# EasyEDA Pro project ProPrj_MN42_2025-04-17.epro, board btnBRD
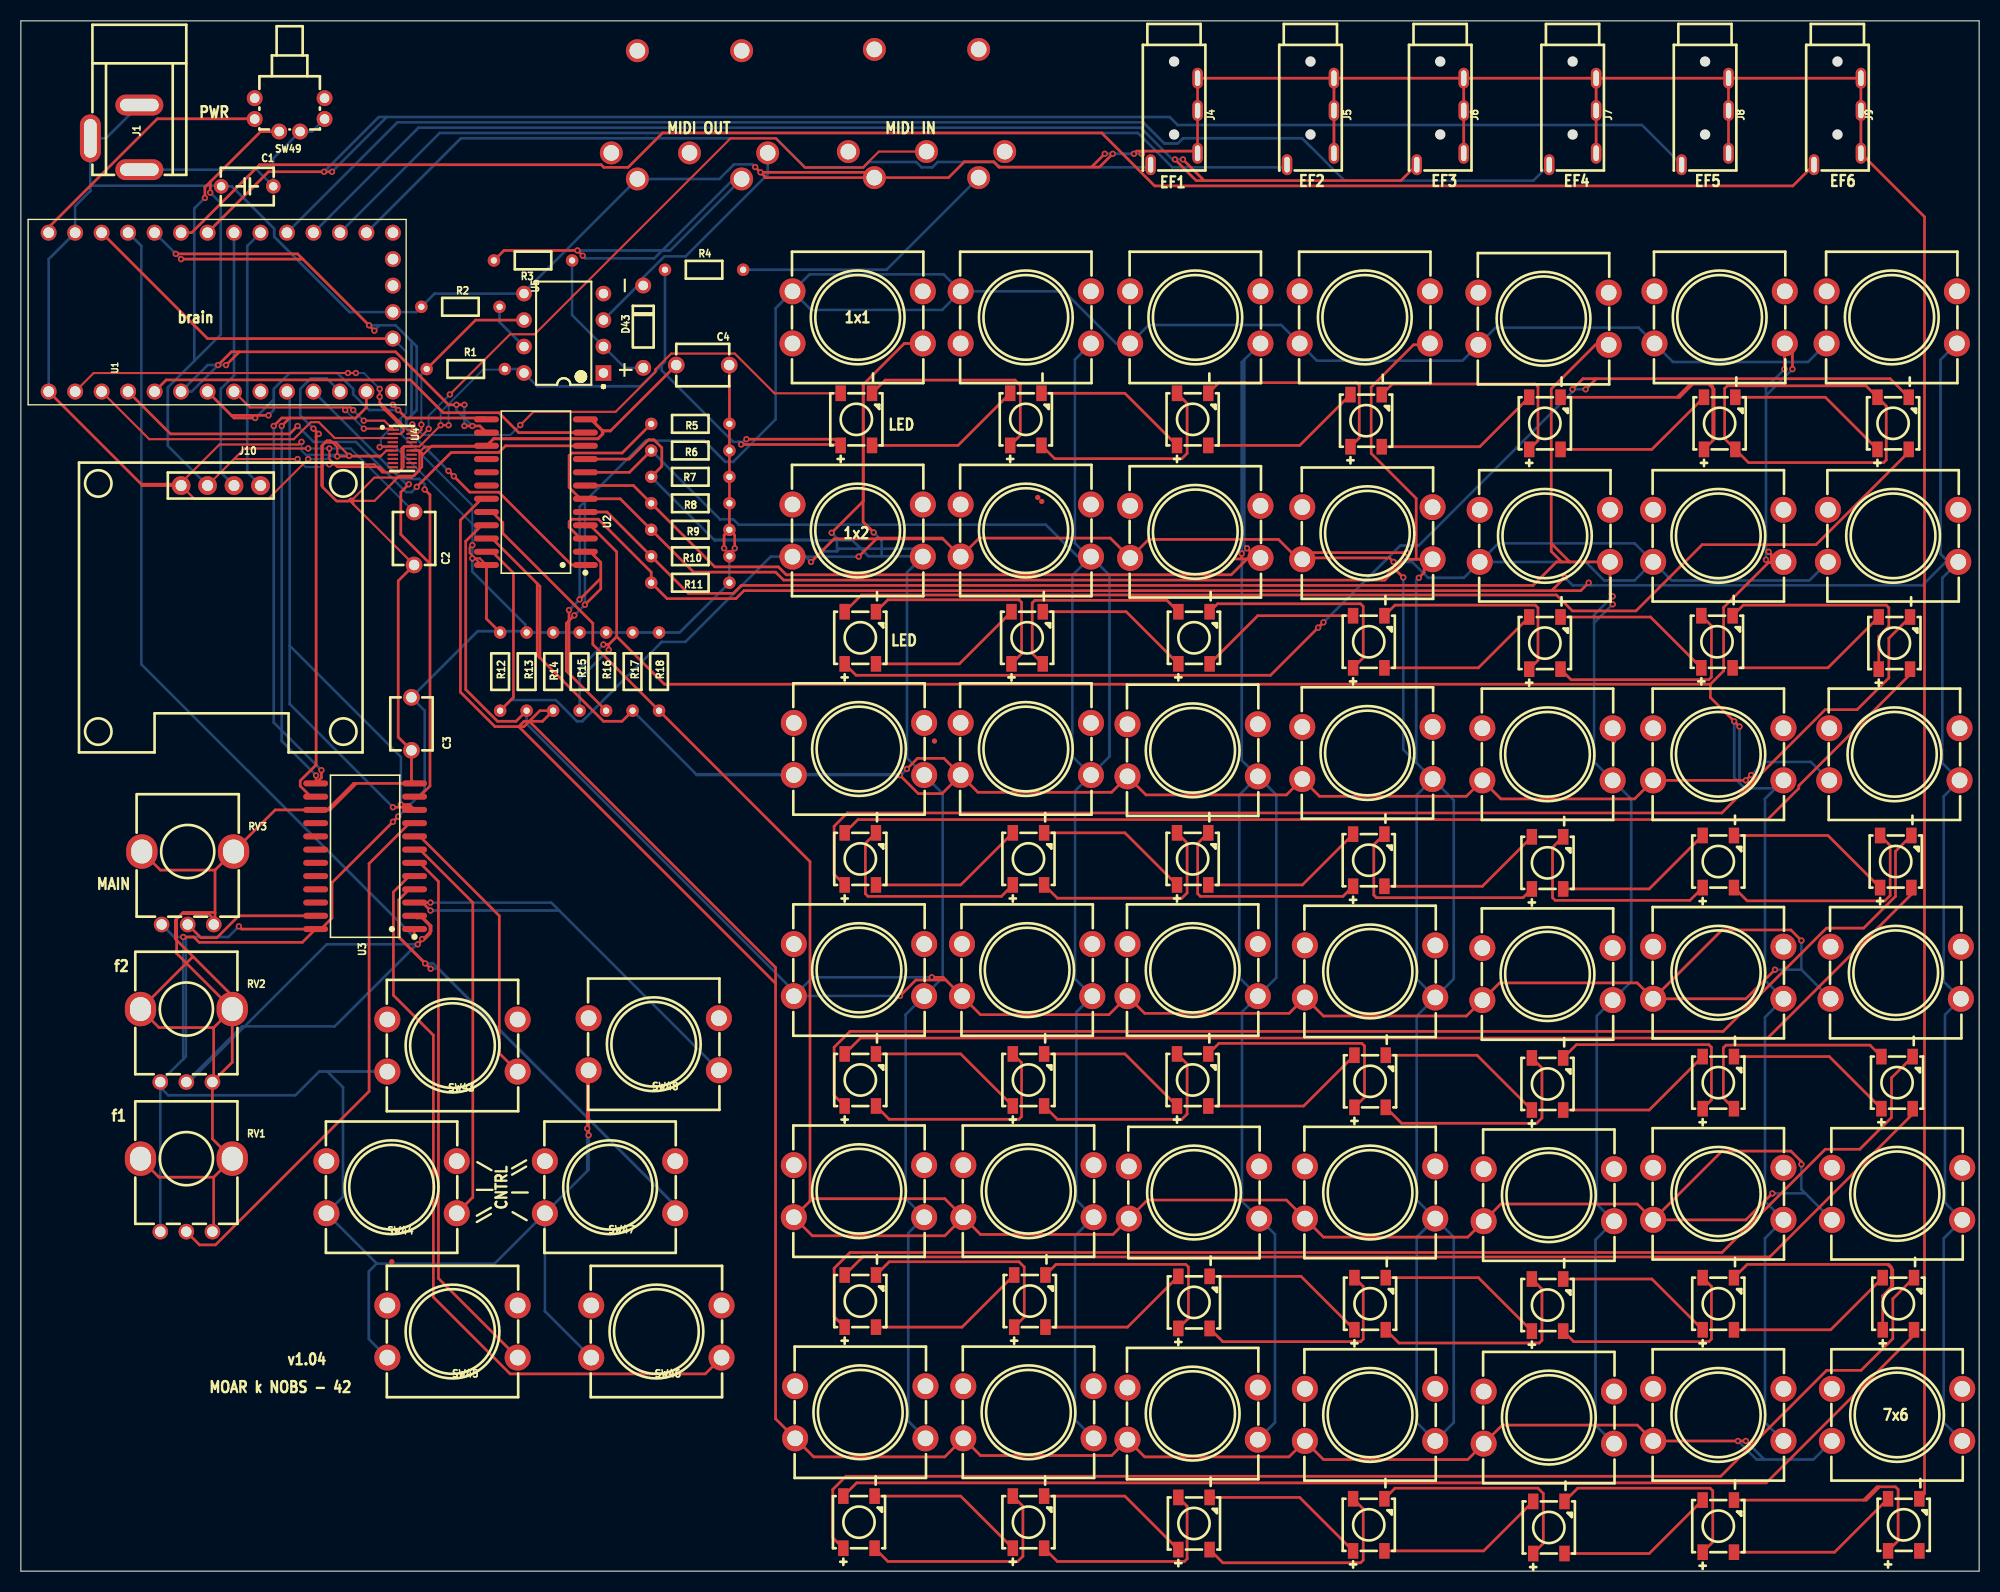
[diagram p1: board, top side]
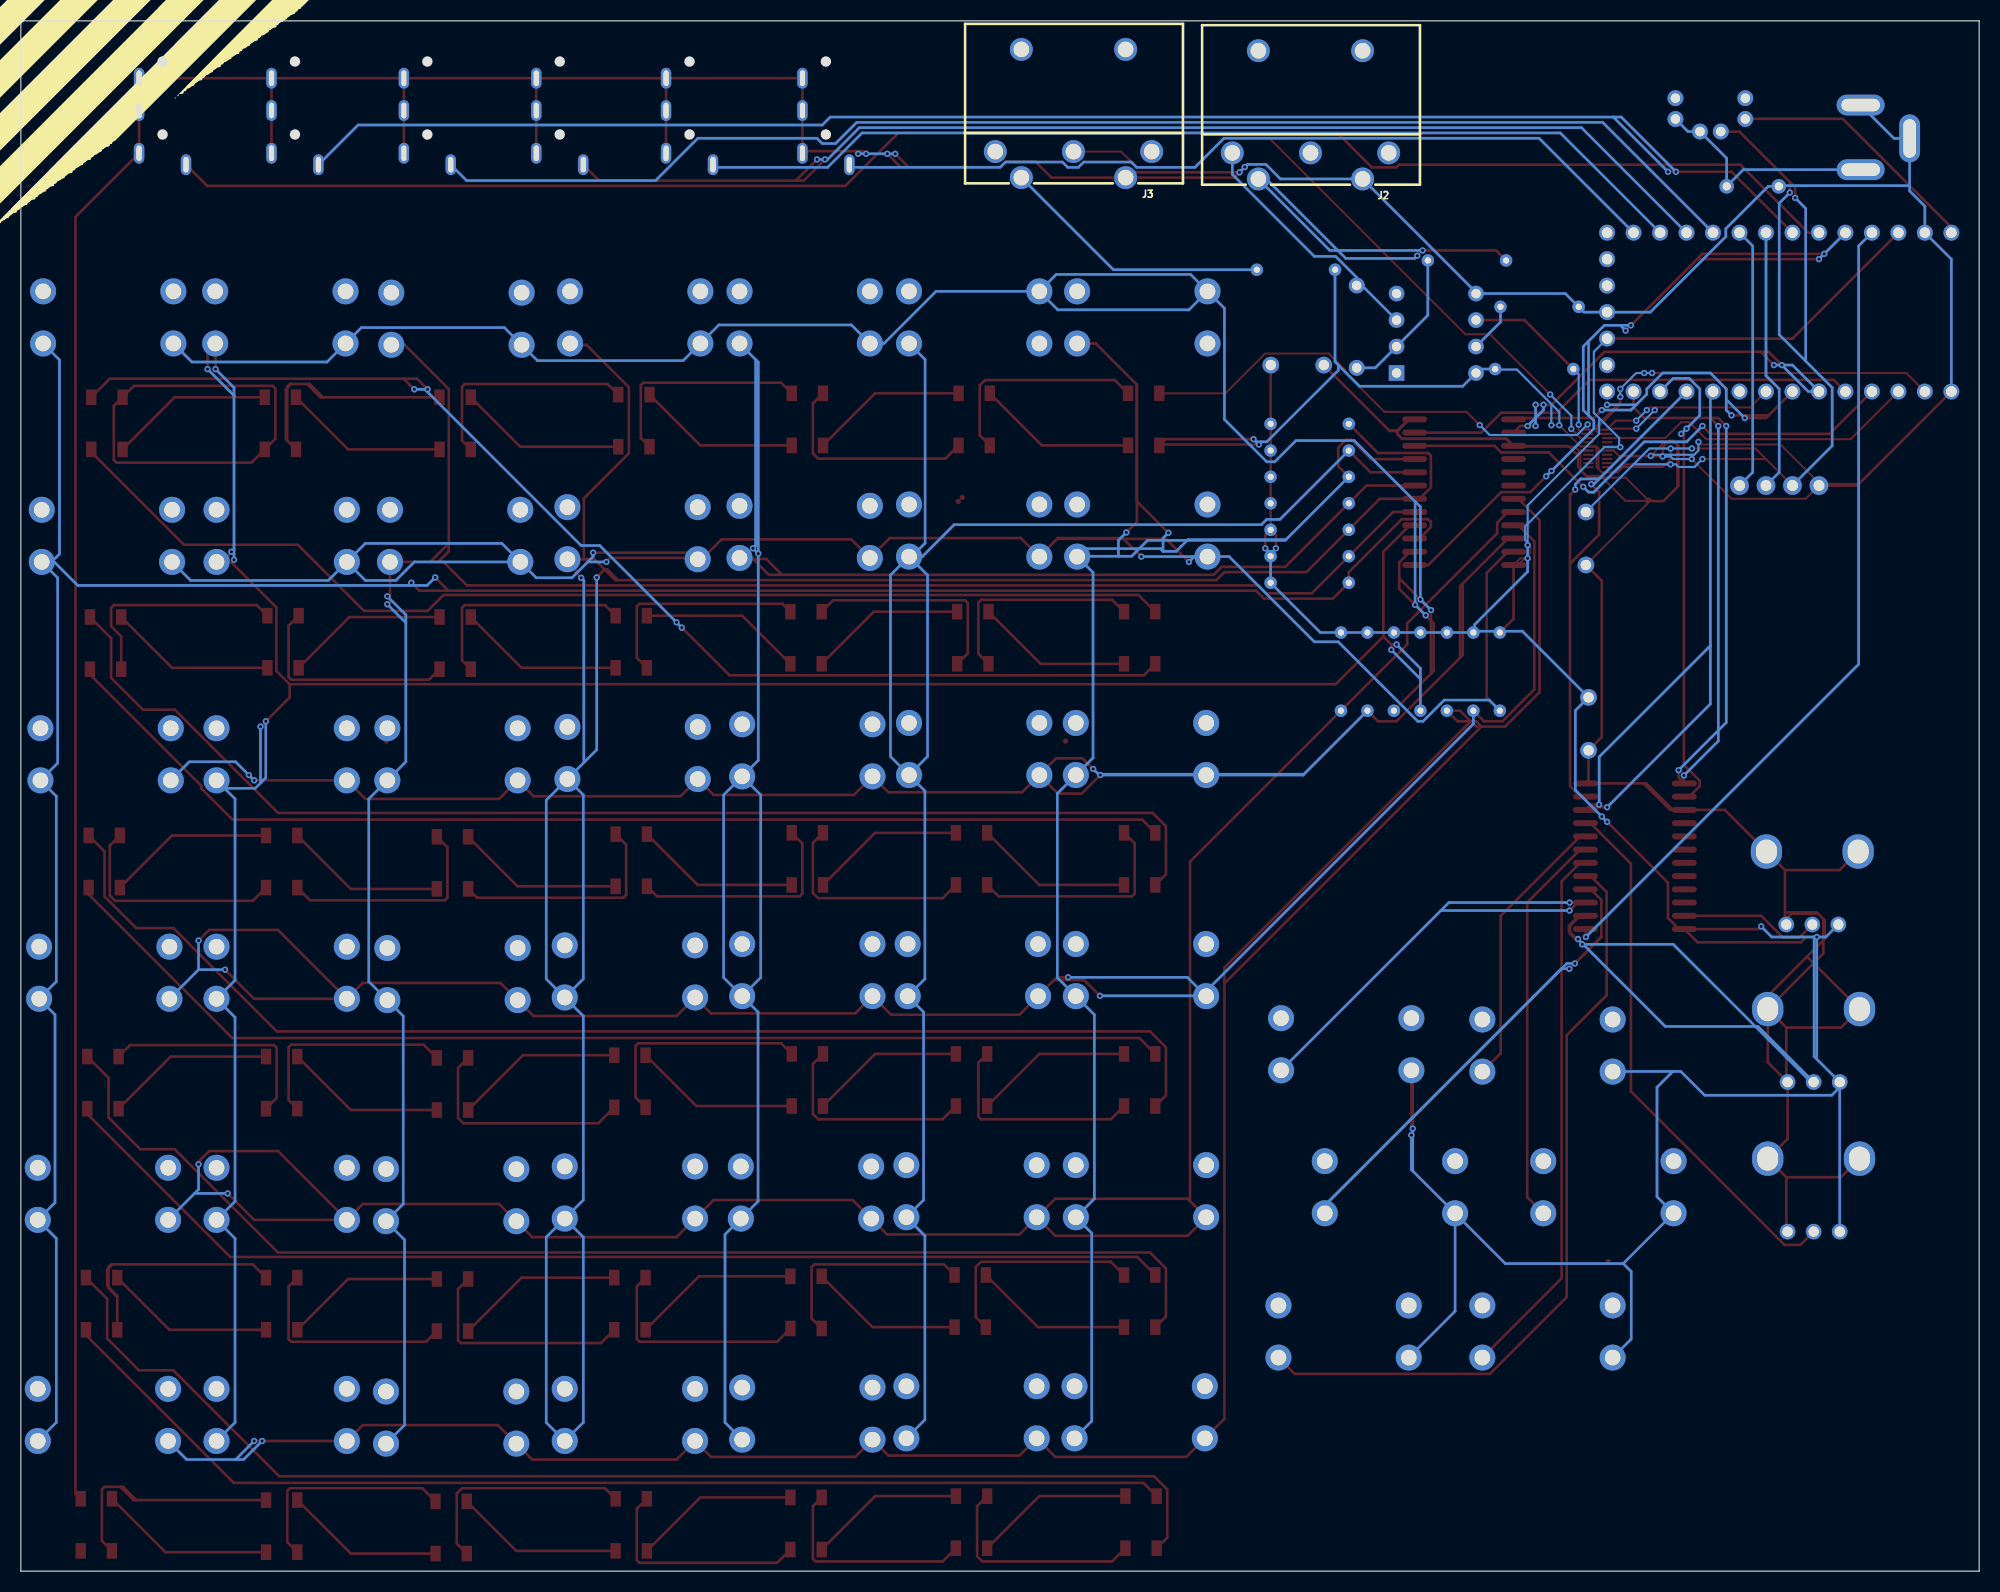
[diagram p2: board, bottom side, seen from below]

Outline 187.83 x 148.72 mm; copper layers: Top Layer, Bottom Layer. Coordinates in mm from the lower left corner of the outline.
Outline path: 0,148.72 0,0 187.83,0 187.83,148.72 0,148.72
Stack: Top Layer 0.035mm / Dielectric1 1.51mm FR4 er 4.5 / Bottom Layer 0.035mm

## Design rules (mm)
spacing safeClearance (default): track to track 0.152, other pairs 0.152 to 0.3
track width trackWidth (default): min 0.127, default 0.254, max 2.54
differential pair differentialPair (default): width min 0.127, default 0.254, max 2.54; gap min 0.152, default 0.152
via viaSize (default): diameter min 0.5, default 0.61, max 10; hole min 0.3, default 0.305, max 6

## Placement (name value [footprint] x y rotation side)
C1  10uF  [CAP-TH_L5.5-W3.5-P5.00-D0.5]  21.72 132.84 0 top
C2  100nF  [CAP-TH_L5.0-W4.0-P5.00-D1.0]  37.72 99.06 270 top
C3  100nF  [CAP-TH_L5.0-W4.0-P5.00-D1.0]  37.47 81.28 90 top
C4  100nF  [CAP-TH_L5.0-W4.0-P5.00-D1.0]  65.41 115.7 0 top
D1  XL-5050RGBC-WS2812B  [LED-SMD_4P-L5.0-W5.0-BL_XL-5050RGBC]  80.14 110.49 0 top
D2  XL-5050RGBC-WS2812B  [LED-SMD_4P-L5.0-W5.0-BL_XL-5050RGBC]  96.39 110.49 0 top
D3  XL-5050RGBC-WS2812B  [LED-SMD_4P-L5.0-W5.0-BL_XL-5050RGBC]  112.4 110.49 0 top
D4  XL-5050RGBC-WS2812B  [LED-SMD_4P-L5.0-W5.0-BL_XL-5050RGBC]  129.03 110.36 0 top
D5  XL-5050RGBC-WS2812B  [LED-SMD_4P-L5.0-W5.0-BL_XL-5050RGBC]  146.18 110.11 0 top
D6  XL-5050RGBC-WS2812B  [LED-SMD_4P-L5.0-W5.0-BL_XL-5050RGBC]  162.94 110.11 0 top
D7  XL-5050RGBC-WS2812B  [LED-SMD_4P-L5.0-W5.0-BL_XL-5050RGBC]  179.58 110.11 0 top
D8  XL-5050RGBC-WS2812B  [LED-SMD_4P-L5.0-W5.0-BL_XL-5050RGBC]  80.52 89.54 0 top
D9  XL-5050RGBC-WS2812B  [LED-SMD_4P-L5.0-W5.0-BL_XL-5050RGBC]  96.52 89.54 0 top
D10  XL-5050RGBC-WS2812B  [LED-SMD_4P-L5.0-W5.0-BL_XL-5050RGBC]  112.52 89.54 0 top
D11  XL-5050RGBC-WS2812B  [LED-SMD_4P-L5.0-W5.0-BL_XL-5050RGBC]  129.29 89.15 0 top
D12  XL-5050RGBC-WS2812B  [LED-SMD_4P-L5.0-W5.0-BL_XL-5050RGBC]  146.18 89.03 0 top
D13  XL-5050RGBC-WS2812B  [LED-SMD_4P-L5.0-W5.0-BL_XL-5050RGBC]  162.69 89.15 0 top
D14  XL-5050RGBC-WS2812B  [LED-SMD_4P-L5.0-W5.0-BL_XL-5050RGBC]  179.71 89.03 0 top
D15  XL-5050RGBC-WS2812B  [LED-SMD_4P-L5.0-W5.0-BL_XL-5050RGBC]  80.52 68.33 0 top
D16  XL-5050RGBC-WS2812B  [LED-SMD_4P-L5.0-W5.0-BL_XL-5050RGBC]  96.65 68.33 0 top
D17  XL-5050RGBC-WS2812B  [LED-SMD_4P-L5.0-W5.0-BL_XL-5050RGBC]  112.4 68.33 0 top
D18  XL-5050RGBC-WS2812B  [LED-SMD_4P-L5.0-W5.0-BL_XL-5050RGBC]  129.29 68.2 0 top
D19  XL-5050RGBC-WS2812B  [LED-SMD_4P-L5.0-W5.0-BL_XL-5050RGBC]  146.43 67.95 0 top
D20  XL-5050RGBC-WS2812B  [LED-SMD_4P-L5.0-W5.0-BL_XL-5050RGBC]  162.81 68.07 0 top
D21  XL-5050RGBC-WS2812B  [LED-SMD_4P-L5.0-W5.0-BL_XL-5050RGBC]  179.83 68.07 0 top
D22  XL-5050RGBC-WS2812B  [LED-SMD_4P-L5.0-W5.0-BL_XL-5050RGBC]  80.52 47.12 0 top
D23  XL-5050RGBC-WS2812B  [LED-SMD_4P-L5.0-W5.0-BL_XL-5050RGBC]  96.65 47.12 0 top
D24  XL-5050RGBC-WS2812B  [LED-SMD_4P-L5.0-W5.0-BL_XL-5050RGBC]  112.4 47.12 0 top
D25  XL-5050RGBC-WS2812B  [LED-SMD_4P-L5.0-W5.0-BL_XL-5050RGBC]  129.41 46.99 0 top
D26  XL-5050RGBC-WS2812B  [LED-SMD_4P-L5.0-W5.0-BL_XL-5050RGBC]  146.43 46.74 0 top
D27  XL-5050RGBC-WS2812B  [LED-SMD_4P-L5.0-W5.0-BL_XL-5050RGBC]  162.81 46.86 0 top
D28  XL-5050RGBC-WS2812B  [LED-SMD_4P-L5.0-W5.0-BL_XL-5050RGBC]  179.96 46.86 0 top
D29  XL-5050RGBC-WS2812B  [LED-SMD_4P-L5.0-W5.0-BL_XL-5050RGBC]  80.52 25.91 0 top
D30  XL-5050RGBC-WS2812B  [LED-SMD_4P-L5.0-W5.0-BL_XL-5050RGBC]  96.77 25.91 0 top
D31  XL-5050RGBC-WS2812B  [LED-SMD_4P-L5.0-W5.0-BL_XL-5050RGBC]  112.52 25.78 0 top
D32  XL-5050RGBC-WS2812B  [LED-SMD_4P-L5.0-W5.0-BL_XL-5050RGBC]  129.41 25.65 0 top
D33  XL-5050RGBC-WS2812B  [LED-SMD_4P-L5.0-W5.0-BL_XL-5050RGBC]  146.43 25.53 0 top
D34  XL-5050RGBC-WS2812B  [LED-SMD_4P-L5.0-W5.0-BL_XL-5050RGBC]  162.81 25.65 0 top
D35  XL-5050RGBC-WS2812B  [LED-SMD_4P-L5.0-W5.0-BL_XL-5050RGBC]  180.09 25.65 0 top
D36  XL-5050RGBC-WS2812B  [LED-SMD_4P-L5.0-W5.0-BL_XL-5050RGBC]  80.39 4.7 0 top
D37  XL-5050RGBC-WS2812B  [LED-SMD_4P-L5.0-W5.0-BL_XL-5050RGBC]  96.65 4.7 0 top
D38  XL-5050RGBC-WS2812B  [LED-SMD_4P-L5.0-W5.0-BL_XL-5050RGBC]  112.52 4.57 0 top
D39  XL-5050RGBC-WS2812B  [LED-SMD_4P-L5.0-W5.0-BL_XL-5050RGBC]  129.29 4.45 0 top
D40  XL-5050RGBC-WS2812B  [LED-SMD_4P-L5.0-W5.0-BL_XL-5050RGBC]  146.56 4.19 0 top
D41  XL-5050RGBC-WS2812B  [LED-SMD_4P-L5.0-W5.0-BL_XL-5050RGBC]  162.81 4.32 0 top
D42  XL-5050RGBC-WS2812B  [LED-SMD_4P-L5.0-W5.0-BL_XL-5050RGBC]  180.59 4.45 0 top
D43  1N4148PF  [DO-35_BD1.9-L3.9-P7.90-D0.5-FD]  59.7 119.38 90 top
J1  DC005  [DC-IN-TH_DC005]  9.02 137.54 270 top
J2  DIN-504B-M10  [CONN-TH_DIN-504B-M10]  64.14 139.7 0 bottom
J3  DIN-504B-M10  [CONN-TH_DIN-504B-M10]  86.87 139.83 0 bottom
J4  HC-PJ-320A  [AUDIO-SMD_HC-PJ-320A]  110.62 139.06 270 top
J5  HC-PJ-320A  [AUDIO-SMD_HC-PJ-320A]  123.7 139.06 270 top
J6  HC-PJ-320A  [AUDIO-SMD_HC-PJ-320A]  136.14 139.06 270 top
J7  HC-PJ-320A  [AUDIO-SMD_HC-PJ-320A]  148.84 139.06 270 top
J8  HC-PJ-320A  [AUDIO-SMD_HC-PJ-320A]  161.54 139.06 270 top
J9  HC-PJ-320A  [AUDIO-SMD_HC-PJ-320A]  174.24 139.06 270 top
J10  HS96L03W2C03  [OLED-TH_L27.8-W27.2-P2.54_C9900033791]  19.18 104.14 0 top
R1  220Ω  [RES-TH_BD1.7-L3.5-P7.50-D0.5]  42.67 115.32 0 top
R2  4.7kΩ  [RES-TH_BD1.7-L3.5-P7.50-D0.5]  42.16 121.29 0 top
R3  220Ω  [RES-TH_BD1.7-L3.5-P7.50-D0.5]  49.13 125.73 180 top
R4  220Ω  [RES-TH_BD1.7-L3.5-P7.50-D0.5]  65.53 124.84 0 top
R5  10kΩ  [RES-TH_BD1.7-L3.5-P7.50-D0.5]  64.21 110.06 0 top
R6  10kΩ  [RES-TH_BD1.7-L3.5-P7.50-D0.5]  64.21 107.5 0 top
R7  10kΩ  [RES-TH_BD1.7-L3.5-P7.50-D0.5]  64.21 104.98 0 top
R8  10kΩ  [RES-TH_BD1.7-L3.5-P7.50-D0.5]  64.21 102.44 0 top
R9  10kΩ  [RES-TH_BD1.7-L3.5-P7.50-D0.5]  64.21 99.9 0 top
R10  10kΩ  [RES-TH_BD1.7-L3.5-P7.50-D0.5]  64.21 97.36 0 top
R11  10kΩ  [RES-TH_BD1.7-L3.5-P7.50-D0.5]  64.21 94.82 0 top
R12  10kΩ  [RES-TH_BD1.7-L3.5-P7.50-D0.5]  45.97 86.29 90 top
R13  10kΩ  [RES-TH_BD1.7-L3.5-P7.50-D0.5]  48.51 86.29 90 top
R14  10kΩ  [RES-TH_BD1.7-L3.5-P7.50-D0.5]  51.05 86.29 90 top
R15  10kΩ  [RES-TH_BD1.7-L3.5-P7.50-D0.5]  53.59 86.29 90 top
R16  10kΩ  [RES-TH_BD1.7-L3.5-P7.50-D0.5]  56.13 86.29 90 top
R17  10kΩ  [RES-TH_BD1.7-L3.5-P7.50-D0.5]  58.67 86.29 90 top
R18  10kΩ  [RES-TH_BD1.7-L3.5-P7.50-D0.5]  61.21 86.29 90 top
RV1  10kΩ  [RES-ADJ-TH_RK09K1130A5R]  15.88 36.07 0 top
RV2  10kΩ  [RES-ADJ-TH_RK09K1130A5R]  15.88 50.42 0 top
RV3  10kΩ  [RES-ADJ-TH_RK09K1130A5R]  16 65.53 0 top
SW1  HX B3F-4055-Y  [SW-TH_4P-L12.0-W12.0-P5.00-LS12.5]  80.26 120.27 180 top
SW2  HX B3F-4055-Y  [SW-TH_4P-L12.0-W12.0-P5.00-LS12.5]  96.39 120.27 180 top
SW3  HX B3F-4055-Y  [SW-TH_4P-L12.0-W12.0-P5.00-LS12.5]  112.65 120.27 180 top
SW4  HX B3F-4055-Y  [SW-TH_4P-L12.0-W12.0-P5.00-LS12.5]  128.91 120.27 180 top
SW5  HX B3F-4055-Y  [SW-TH_4P-L12.0-W12.0-P5.00-LS12.5]  146.05 120.14 180 top
SW6  HX B3F-4055-Y  [SW-TH_4P-L12.0-W12.0-P5.00-LS12.5]  162.94 120.27 180 top
SW7  HX B3F-4055-Y  [SW-TH_4P-L12.0-W12.0-P5.00-LS12.5]  179.45 120.27 180 top
SW8  HX B3F-4055-Y  [SW-TH_4P-L12.0-W12.0-P5.00-LS12.5]  80.26 99.82 180 top
SW9  HX B3F-4055-Y  [SW-TH_4P-L12.0-W12.0-P5.00-LS12.5]  96.39 99.82 180 top
SW10  HX B3F-4055-Y  [SW-TH_4P-L12.0-W12.0-P5.00-LS12.5]  112.65 99.7 180 top
SW11  HX B3F-4055-Y  [SW-TH_4P-L12.0-W12.0-P5.00-LS12.5]  129.16 99.57 180 top
SW12  HX B3F-4055-Y  [SW-TH_4P-L12.0-W12.0-P5.00-LS12.5]  146.18 99.31 180 top
SW13  HX B3F-4055-Y  [SW-TH_4P-L12.0-W12.0-P5.00-LS12.5]  162.81 99.31 180 top
SW14  HX B3F-4055-Y  [SW-TH_4P-L12.0-W12.0-P5.00-LS12.5]  179.58 99.31 180 top
SW15  HX B3F-4055-Y  [SW-TH_4P-L12.0-W12.0-P5.00-LS12.5]  80.39 78.87 180 top
SW16  HX B3F-4055-Y  [SW-TH_4P-L12.0-W12.0-P5.00-LS12.5]  96.39 78.87 180 top
SW17  HX B3F-4055-Y  [SW-TH_4P-L12.0-W12.0-P5.00-LS12.5]  112.4 78.74 180 top
SW18  HX B3F-4055-Y  [SW-TH_4P-L12.0-W12.0-P5.00-LS12.5]  129.16 78.49 180 top
SW19  HX B3F-4055-Y  [SW-TH_4P-L12.0-W12.0-P5.00-LS12.5]  146.43 78.36 180 top
SW20  HX B3F-4055-Y  [SW-TH_4P-L12.0-W12.0-P5.00-LS12.5]  162.81 78.36 180 top
SW21  HX B3F-4055-Y  [SW-TH_4P-L12.0-W12.0-P5.00-LS12.5]  179.71 78.36 180 top
SW22  HX B3F-4055-Y  [SW-TH_4P-L12.0-W12.0-P5.00-LS12.5]  80.39 57.66 180 top
SW23  HX B3F-4055-Y  [SW-TH_4P-L12.0-W12.0-P5.00-LS12.5]  96.52 57.66 180 top
SW24  HX B3F-4055-Y  [SW-TH_4P-L12.0-W12.0-P5.00-LS12.5]  112.4 57.66 180 top
SW25  HX B3F-4055-Y  [SW-TH_4P-L12.0-W12.0-P5.00-LS12.5]  129.41 57.53 180 top
SW26  HX B3F-4055-Y  [SW-TH_4P-L12.0-W12.0-P5.00-LS12.5]  146.43 57.28 180 top
SW27  HX B3F-4055-Y  [SW-TH_4P-L12.0-W12.0-P5.00-LS12.5]  162.81 57.4 180 top
SW28  HX B3F-4055-Y  [SW-TH_4P-L12.0-W12.0-P5.00-LS12.5]  179.83 57.4 180 top
SW29  HX B3F-4055-Y  [SW-TH_4P-L12.0-W12.0-P5.00-LS12.5]  80.39 36.45 180 top
SW30  HX B3F-4055-Y  [SW-TH_4P-L12.0-W12.0-P5.00-LS12.5]  96.65 36.45 180 top
SW31  HX B3F-4055-Y  [SW-TH_4P-L12.0-W12.0-P5.00-LS12.5]  112.52 36.32 180 top
SW32  HX B3F-4055-Y  [SW-TH_4P-L12.0-W12.0-P5.00-LS12.5]  129.41 36.32 180 top
SW33  HX B3F-4055-Y  [SW-TH_4P-L12.0-W12.0-P5.00-LS12.5]  146.56 36.07 180 top
SW34  HX B3F-4055-Y  [SW-TH_4P-L12.0-W12.0-P5.00-LS12.5]  162.81 36.2 180 top
SW35  HX B3F-4055-Y  [SW-TH_4P-L12.0-W12.0-P5.00-LS12.5]  179.96 36.2 180 top
SW36  HX B3F-4055-Y  [SW-TH_4P-L12.0-W12.0-P5.00-LS12.5]  80.52 15.24 180 top
SW37  HX B3F-4055-Y  [SW-TH_4P-L12.0-W12.0-P5.00-LS12.5]  96.65 15.24 180 top
SW38  HX B3F-4055-Y  [SW-TH_4P-L12.0-W12.0-P5.00-LS12.5]  112.4 15.11 180 top
SW39  HX B3F-4055-Y  [SW-TH_4P-L12.0-W12.0-P5.00-LS12.5]  129.41 14.99 180 top
SW40  HX B3F-4055-Y  [SW-TH_4P-L12.0-W12.0-P5.00-LS12.5]  146.56 14.73 180 top
SW41  HX B3F-4055-Y  [SW-TH_4P-L12.0-W12.0-P5.00-LS12.5]  162.81 14.99 180 top
SW42  HX B3F-4055-Y  [SW-TH_4P-L12.0-W12.0-P5.00-LS12.5]  179.96 14.99 180 top
SW43  HX B3F-4055-Y  [SW-TH_4P-L12.0-W12.0-P5.00-LS12.5]  41.4 50.42 180 top
SW44  HX B3F-4055-Y  [SW-TH_4P-L12.0-W12.0-P5.00-LS12.5]  35.56 36.83 180 top
SW45  HX B3F-4055-Y  [SW-TH_4P-L12.0-W12.0-P5.00-LS12.5]  41.4 22.99 180 top
SW46  HX B3F-4055-Y  [SW-TH_4P-L12.0-W12.0-P5.00-LS12.5]  60.96 22.99 180 top
SW47  HX B3F-4055-Y  [SW-TH_4P-L12.0-W12.0-P5.00-LS12.5]  56.52 36.83 180 top
SW48  HX B3F-4055-Y  [SW-TH_4P-L12.0-W12.0-P5.00-LS12.5]  60.71 50.55 180 top
SW49  pwr switch  [SW-TH_TK-6580A-1]  25.78 139.7 180 top
U1  brain - teensy 4.0  [teensy 4.0:MODULE_DEV-15583]  19.18 120.78 90 top
U2  CD74HC4067M96  [SOIC-24_L15.4-W7.5-P1.27-LS10.3-BL]  49.4 103.51 90 top
U3  CD74HC4067M96  [SOIC-24_L15.4-W7.5-P1.27-LS10.3-BL]  33.02 68.58 90 top
U4  TXB0108DQSR  [SON-20_L4.0-W2.0-P0.40-BL]  36.58 107.7 270 top
U5  6N138  [DIP-8_L9.8-W6.6-P2.54-LS7.6-BL]  52.07 118.75 90 top

## Footprints (pads in the part's own frame, mm; a bottom-side part is the same pattern mirrored in y, then rotated)
AUDIO-SMD_HC-PJ-320A
  oval 2x1 hole 1.5x0.5: 1(4.15,-2.25) 2(-4.15,2.25) 3(-1.05,2.25) 4(3.05,2.25)
CAP-TH_L5.0-W4.0-P5.00-D1.0
  round 1.6 hole 1: 1(-2.54,0) 2(2.54,0)
CAP-TH_L5.5-W3.5-P5.00-D0.5
  round 1.4 hole 0.8: 1(-2.5,0) 2(2.5,0)
CONN-TH_DIN-504B-M10
  round 2.2 hole 1.5: 1(-7.5,3.65) 2(-5,6.15) 3(0,3.65) 4(5,6.15) 5(7.5,3.65) 6(-5,-6.15) 7(5,-6.15)
DC-IN-TH_DC005
  oval 2x4.6 hole 1.2x3.7: 1(3.1,2.35) 2(-3.1,2.35)
  oval 4.6x2 hole 3.7x1.2: 3(0.1,-2.35)
DIP-8_L9.8-W6.6-P2.54-LS7.6-BL
  rect 1.5x1.5 hole 0.9: 1(-3.81,-3.81)
  round 1.5 hole 0.9: 2(-1.27,-3.81) 3(1.27,-3.81) 4(3.81,-3.81) 5(3.81,3.81) 6(1.27,3.81) 7(-1.27,3.81) 8(-3.81,3.81)
DO-35_BD1.9-L3.9-P7.90-D0.5-FD
  round 1.524 hole 0.914: 1(-3.95,0) 2(3.95,0)
LED-SMD_4P-L5.0-W5.0-BL_XL-5050RGBC
  rect 1x1.5 smd: 1(-1.5,-2.5) 2(1.5,-2.5) 3(1.5,2.5) 4(-1.5,2.5)
OLED-TH_L27.8-W27.2-P2.54_C9900033791
  round 1.8 hole 1.05: 1(-3.81,0) 2(-1.27,0) 3(1.27,0) 4(3.81,0)
RES-ADJ-TH_RK09K1130A5R
  round 1.5 hole 1: 1(-2.5,-3.5) 2(0,-3.5) 3(2.5,-3.5)
  oval 3x3.3 hole 2x2.3: 4(4.4,3.5) 5(-4.4,3.5)
RES-TH_BD1.7-L3.5-P7.50-D0.5
  round 1.2 hole 0.6: 1(-3.75,0) 2(3.75,0)
SOIC-24_L15.4-W7.5-P1.27-LS10.3-BL
  oval 0.574x2.388 smd: 1(-6.985,-4.744) 2(-5.715,-4.744) 3(-4.445,-4.744) 4(-3.175,-4.744) 5(-1.905,-4.744) 6(-0.635,-4.744) 7(0.635,-4.744) 8(1.905,-4.744) 9(3.175,-4.744) 10(4.445,-4.744) 11(5.715,-4.744) 12(6.985,-4.744) 13(6.985,4.744) 14(5.715,4.744) 15(4.445,4.744) 16(3.175,4.744) 17(1.905,4.744) 18(0.635,4.744) 19(-0.635,4.744) 20(-1.905,4.744) 21(-3.175,4.744) 22(-4.445,4.744) 23(-5.715,4.744) 24(-6.985,4.744)
SON-20_L4.0-W2.0-P0.40-BL
  rect 0.2x1.1 smd: 1(-1.8,-0.85)
  rect 0.2x1 smd: 2(-1.4,-0.9) 3(-1,-0.9) 4(-0.6,-0.9) 5(-0.2,-0.9) 6(0.2,-0.9) 7(0.6,-0.9) 8(1,-0.9) 9(1.4,-0.9) 10(1.8,-0.9) 11(1.8,0.9) 12(1.4,0.9) 13(1,0.9) 14(0.6,0.9) 15(0.2,0.9) 16(-0.2,0.9) 17(-0.6,0.9) 18(-1,0.9) 19(-1.4,0.9) 20(-1.8,0.9)
SW-TH_4P-L12.0-W12.0-P5.00-LS12.5
  round 2.5 hole 1.5: 1(-6.25,2.5) 2(6.25,2.5) 3(-6.25,-2.5) 4(6.25,-2.5)
SW-TH_TK-6580A-1
  round 1.524 hole 0.914: 1(3.35,-1.6) 2(3.35,0.4) 3(-3.35,-1.6) 4(-3.35,0.4) 5(1,1.6) 6(-1,1.6)
teensy 4.0:MODULE_DEV-15583
  round 1.53 hole 1.02: 0(-7.62,13.97) 1(-7.62,11.43) 2(-7.62,8.89) 3(-7.62,6.35) 3.3V_1(-2.54,-16.51) 3.3V_2(7.62,11.43) 4(-7.62,3.81) 5(-7.62,1.27) 6(-7.62,-1.27) 7(-7.62,-3.81) 8(-7.62,-6.35) 9(-7.62,-8.89) 10(-7.62,-11.43) 11(-7.62,-13.97) 12(-7.62,-16.51) 13(7.62,-16.51) 14(7.62,-13.97) 15(7.62,-11.43) 16(7.62,-8.89) 17(7.62,-6.35) 18(7.62,-3.81) 19(7.62,-1.27) 20(7.62,1.27) 21(7.62,3.81) 22(7.62,6.35) 23(7.62,8.89) G1(-7.62,16.51) G2(0,-16.51) G3(7.62,13.97) ON-OFF(5.08,-16.51) PGM(2.54,-16.51) VBAT(-5.08,-16.51) VIN(7.62,16.51)

## Nets
As in the schematic.

Pads without a net: D42 2; J2 1 3 6 7; J3 1 5 6 7; SW1 2 3; SW2 2 3; SW3 3 4; SW4 3 4; SW5 3 4; SW6 3 4; SW7 3 4; SW8 3 4; SW9 3 4; SW10 3 4; SW11 3 4; SW12 3 4; SW13 3 4; SW14 3 4; SW15 3 4; SW16 3 4; SW17 3 4; SW18 3 4; SW19 3 4; SW20 3 4; SW21 3 4; SW22 3 4; SW23 3 4; SW24 3 4; SW25 3 4; SW26 3 4; SW27 3 4; SW28 3 4; SW29 3 4; SW30 3 4; SW31 3 4; SW32 3 4; SW33 3 4; SW34 3 4; SW35 3 4; SW36 3 4; SW37 3 4; SW38 3 4; SW39 3 4; SW40 3 4; SW41 3 4; SW42 3 4; SW43 3 4; SW44 3 4; SW45 3 4; SW46 3 4; SW47 3 4; SW48 3 4; SW49 1 3; U1 7 12 13 ON-OFF PGM VBAT; U2 16 17 18; U3 16 17 18 19 20 21 22; U4 4 7 8 9 10 11 12 13 14 17; U5 1 4

## Via types
v1: diameter 0.61, hole 0.305, Top Layer to Bottom Layer, 127 vias

## Routing (per net, layer and track width the routed paths; a pad name or vN(x,y) marks a point on that pad's centre or on a via; arc(x,y) is an arc through that point)
3VDC: length 367.6
  Top Layer w0.2: v1(34.42,107.82) 34.49,107.9 U4.5 ; 43.56,97.16 44.2,96.52 U2.24 44.02,97.16 43.56,97.16 ; 43.56,97.16 v1(43.31,97.16) ; 43.56,97.16 43.05,97.66 43.05,98.17 v1(43.31,98.43)
  Top Layer w0.254: v1(67.45,98.12) 67.45,99.39 R9.2 ; v1(20.91,61.85) 21.16,61.6 U3.24 ; U3.24 27.01,60.33 17.1,60.33 16.59,60.83 v1(15.58,60.83) ; U3.24 28.78,61.6 29.84,62.66 29.84,66.04 v1(35.69,71.88) v1(36.2,72.39) ; v1(68.47,98.12) 68.47,99.39 R9.2 ; R9.2 R8.2 R7.2 R6.2 R5.2 67.96,115.68 C4.2 ; v1(54.46,41.82) SW48.2 54.33,47.92 v1(54.33,42.46) ; U1.3.3V_2 17.91,118.24 U1.3.3V_1 ; U2.24 44.66,91.36 R12.2
  Bottom Layer w0.2: 43.31,100.46 43.56,100.2 43.56,98.93 43.31,98.68 ; 43.31,100.46 43.31,98.68 ; 43.31,100.46 43.31,102.24 36.45,109.09 36.45,110.62 ; 43.31,100.46 35.94,107.82 v1(34.42,107.82) 34.53,107.94 34.53,108.7 36.45,110.62 ; 43.31,98.68 v1(43.31,98.43) ; 36.45,110.62 36.96,111.13 36.96,116.97 U1.3.3V_1
  Bottom Layer w0.254: 54.33,38.39 v1(54.33,42.46) ; 54.33,38.39 54.46,38.52 v1(54.46,41.82) ; 54.33,38.39 SW47.2 ; 29.38,47.94 35.14,47.94 SW43.2 ; 29.38,47.94 28.61,47.94 26.33,45.65 14.14,45.65 13.38,46.41 ; 29.38,47.94 30.9,46.41 30.9,35.92 SW44.2 34.14,29.5 ; SW47.2 45.44,29.5 34.14,29.5 ; SW47.2 50.27,24.93 SW46.2 ; 34.14,29.5 33.37,28.74 33.37,22.27 SW45.2 ; v1(20.91,61.85) 19.89,60.83 15.83,60.83 ; 15.83,60.83 15.83,49.37 15.58,49.12 ; 15.83,60.83 v1(15.58,60.83) ; v1(15.58,60.83) 15.58,49.12 ; v1(15.58,60.83) 14.7,60.83 RV3.1 ; 15.58,49.12 RV2.1 13.38,46.41 ; 48.39,90.17 48.39,90.81 43.31,95.89 v1(43.31,97.16) v1(43.31,98.43) ; 48.39,90.17 R13.2 R14.2 R15.2 R16.2 R17.2 R18.2 63.19,90.04 R11.2 R10.2 67.96,97.61 ; 48.39,90.17 43.81,90.17 C3.2 38.73,82.55 38.73,74.93 v1(36.2,72.39) v1(35.69,71.88) ; 67.96,97.61 v1(68.47,98.12) ; 67.96,97.61 v1(67.45,98.12) ; 13.38,46.41 RV1.1
5VDC: length 188.9
  Top Layer w0.2: 30.1,106.17 30.35,105.92 34.16,105.92 ; 30.1,106.17 v1(29.59,106.17) ; 30.1,106.17 29.59,106.68 v1(29.59,107.7) ; 30.1,106.17 33.91,106.17 34.16,105.92 ; 36.51,105.73 36.2,105.41 34.92,105.41 ; 36.51,105.73 36.7,105.92 36.7,107.74 36.85,107.89 37.47,107.89 U4.16 ; 36.51,105.73 36.51,107.7 36.71,107.9 U4.16 ; 34.16,105.92 34.67,105.41 34.92,105.41 ; 34.16,105.92 34.42,105.92 34.92,105.41 ; U4.16 38.24,107.9 v1(40.27,109.93) v1(41.03,109.93) ; 20.45,106.68 21.46,107.7 v1(27.56,107.7) ; 20.45,106.68 v1(26.54,106.68) ; 20.45,106.68 J10.2
  Top Layer w0.254: 78.55,108.08 78.04,108.59 v1(69.6,108.59) ; 78.55,108.08 v1(69.09,108.08) ; 78.55,108.08 D1.1 ; v1(17.65,131.73) 17.65,132.75 18.16,133.26 ; v1(18.16,132.24) 18.16,133.26 ; 18.16,133.26 22.99,138.08 24.77,138.08 SW49.5
  Bottom Layer w0.2: v1(40.27,109.93) 40.27,111.2 41.03,111.96 ; R1.2 46.37,115.26 44.33,115.26 41.03,111.96 ; 33.15,106.17 v1(29.59,106.17) 29.08,106.17 28.83,105.92 27.31,105.92 v1(26.54,106.68) ; 33.15,106.17 C2.1 ; 33.15,106.17 31.62,107.7 v1(29.59,107.7) v1(27.56,107.7) ; 41.03,111.96 v1(41.03,109.93)
  Bottom Layer w0.254: 16.64,116.08 19.18,118.62 19.18,131.23 v1(18.16,132.24) ; 16.64,116.08 14.1,113.54 14.1,107.95 J10.2 ; 16.64,116.08 16.64,130.72 v1(17.65,131.73) ; 61.47,115.7 61.47,115.19 68.33,108.33 68.83,108.33 ; 61.47,115.7 59.44,113.67 49.53,113.67 U5.8 47.88,115.32 R1.2 ; 61.47,115.7 61.78,116.01 R4.1 ; 68.83,108.33 v1(69.09,108.08) ; 68.83,108.33 69.34,108.33 v1(69.6,108.59)
GND: length 718.5
  Top Layer w0.2: 29.9,108.26 30.23,108.26 v1(31.5,106.99) 34.54,106.99 ; 29.9,108.26 29.7,108.46 29.34,108.46 28.83,107.95 28.83,104.14 28.96,104.01 ; 29.9,108.26 30.35,107.8 v1(30.35,106.93) 34.5,106.93 ; 29.9,108.26 29.21,108.26 28.96,108 28.96,104.01 ; 34.54,106.99 35.05,107.5 ; 34.54,106.99 34.49,106.94 ; 31.57,102.67 31.88,102.67 ; 31.57,102.67 31.88,102.36 ; 31.57,102.67 31.42,102.67 ; 31.88,102.67 31.88,102.87 ; 31.88,102.67 31.88,102.36 ; 31.88,102.67 33.92,102.67 36.15,104.9 ; 35.05,107.5 35.06,107.5 ; 35.05,107.5 U4.6 ; 38.24,105.68 38.24,105.58 37.73,105.07 37.64,105.07 ; 38.24,105.68 38.24,107.36 ; 38.24,105.68 38.48,105.92 38.48,107 ; 38.24,105.68 37.64,105.07 ; 30.3,102.67 30.35,102.62 31.37,102.62 31.42,102.67 ; 30.3,102.67 30.23,102.67 28.96,103.94 28.96,104.01 ; 30.3,102.67 31.42,102.67 ; 30.3,102.67 28.96,104.01 ; 37.64,105.07 37.47,104.9 36.15,104.9 ; 37.64,105.07 36.32,105.07 36.15,104.9 ; 38.31,107.43 38.75,107.87 39.35,107.87 ; 38.31,107.43 38.23,107.51 37.49,107.51 U4.15 38.1,107.5 38.24,107.36 ; 38.31,107.43 38.48,107.25 38.48,107 ; 38.31,107.43 38.24,107.36 ; 36.15,104.9 33.91,104.9 31.88,102.87 ; v1(27.56,106.68) 23.75,102.87 16.64,102.87 J10.1 ; 31.88,102.36 C2.2 ; 31.42,102.67 31.62,102.87 31.88,102.87 ; 38.48,107 39.35,107.87 ; v1(26.92,108.33) 26.67,108.08 19.05,108.08 15.24,104.27 ; 39.35,107.87 39.43,107.95 U2.15 44.59,107.87 39.35,107.87
  Top Layer w0.254: 14.95,62.56 14.81,62.43 14.81,60.65 14.95,60.52 ; 14.95,62.56 14.95,60.52 ; 14.95,62.56 15.45,63.07 ; 11.56,104.27 11.68,104.14 J10.1 15.24,104.27 11.56,104.27 ; 11.56,104.27 U1.G1 ; J5.2 J5.3 J5.4 ; J5.2 J6.2 ; J5.2 J4.2 J4.3 J4.4 112.66,136.22 107.78,136.22 ; 18.5,37.79 RV1.4 18.38,41.47 RV2.3 18.5,47.04 ; 18.5,37.79 13.25,37.79 RV1.5 ; 18.5,37.79 18.5,32.69 RV1.3 ; RV2.4 20.28,55.19 16.59,58.87 ; RV2.4 15.88,58.32 ; RV2.4 20.28,48.82 18.5,47.04 ; RV2.4 18.5,52.14 ; 56.56,109.39 56.55,109.38 55.83,109.38 ; 56.56,109.39 C4.1 ; 56.56,109.39 55.83,109.39 ; 18.62,67.25 18.62,63.19 ; 18.62,67.25 13.38,67.25 11.6,69.03 ; 18.62,67.25 RV3.4 24.39,73.03 U3.15 29.38,73.03 ; 18.62,63.19 18.62,62.68 ; 18.62,63.19 15.58,63.19 15.45,63.07 ; 45.34,108.62 55.33,108.62 55.33,108.63 ; 45.34,108.62 45.33,108.62 U2.15 ; 45.34,108.62 44.59,107.87 ; 45.34,108.62 45.35,108.63 55.33,108.63 ; 102.7,134.69 93.81,134.69 93.3,135.2 90.5,135.2 88.98,133.68 J3.2 ; 102.7,134.69 v1(103.97,135.96) ; 102.7,134.69 103.46,134.69 v1(104.73,135.96) ; 18.5,62.56 17.99,63.07 15.45,63.07 ; 18.5,62.56 RV3.3 18.62,62.15 18.62,62.68 ; 18.5,62.56 18.62,62.68 ; J8.4 J8.3 J8.2 ; J6.2 J7.2 ; J6.2 J6.3 J6.4 ; J7.2 J7.3 J7.4 ; J7.2 J8.2 ; 32.18,75.57 U3.12 37.47,75.86 C3.1 36.2,80.01 36.2,95 C2.2 ; 32.18,75.57 31.92,75.57 29.38,73.03 ; 32.18,75.57 29.64,73.03 29.38,73.03 ; 55.76,109.39 54.66,110.49 ; 55.76,109.39 55.76,109.06 ; 55.76,109.39 55.83,109.39 ; 54.66,110.49 U2.12 ; 54.66,110.49 54.73,110.49 55.83,109.39 ; 15.88,58.32 14.95,59.25 14.95,60.52 ; 15.88,58.32 16.43,58.87 16.59,58.87 ; 15.88,58.32 RV2.5 13.25,52.14 18.5,52.14 ; 16.59,58.87 14.95,60.52 ; J3.2 81.36,134.19 v1(70.95,134.19) ; J3.2 71.45,133.68 v1(70.95,134.19) ; 55.76,109.06 55.76,109.03 55.36,108.63 55.33,108.63 ; 55.76,109.06 55.83,109.13 55.83,109.38 ; 55.76,109.06 55.33,108.63 ; v1(70.44,134.69) v1(70.95,134.19) ; 18.5,52.14 18.5,47.04 ; v1(107.52,135.96) 107.78,136.22 ; 107.78,136.22 107.01,136.22 v1(106.76,135.96) ; J8.2 J9.2 J9.3 J9.4 182.59,129.92 182.59,7.44 D42.3 ; 55.83,109.39 55.83,109.38
  Bottom Layer w0.2: v1(26.92,108.33) 26.92,107.5 27.33,107.09 31.39,107.09 v1(31.5,106.99) ; v1(30.35,106.93) 29.59,106.93 29.34,106.68 v1(27.56,106.68)
  Bottom Layer w0.254: v1(107.52,135.96) v1(106.76,135.96) v1(104.73,135.96) v1(103.97,135.96) ; v1(70.95,134.19) v1(70.44,134.69) 70.18,134.95 68.41,134.95 67.01,133.55 J2.2 48.26,122.68 48.26,122.56 39.68,122.56 R2.1 37.91,120.78 U1.G2 31.54,120.78 24.3,128.02 24.3,128.78 20.23,132.84 C1.1 19.15,132.91 6.67,132.91 ; 6.67,132.91 J1.3 8.17,137.44 J1.2 ; 6.67,132.91 6.67,132.4 5.21,130.94 U1.G3 2.67,125.86 U1.G1
COL1: length 211
  Top Layer w0.254: 52.58,91.18 v1(53.09,91.69) ; 52.58,91.18 v1(52.58,92.19) ; 52.58,91.18 52.32,90.92 52.32,86.35 52.58,86.1 ; 52.58,91.18 52.58,86.1 ; v1(54.1,92.7) 55.63,94.23 55.63,95.24 ; U2.2 54.6,97.79 55.63,96.77 55.63,95.24 ; 55.63,95.24 v1(53.59,93.21) ; R16.1 52.58,86.1
  Bottom Layer w0.254: SW2.4 88.37,120.99 75.79,120.99 SW1.4 ; SW2.4 88.52,124.39 75.64,124.39 SW1.4 ; SW2.4 100.05,122.77 105.05,117.77 SW3.2 108.18,119.55 120.88,119.55 SW4.2 124.31,116.12 138.28,116.12 SW5.2 141.45,119.29 155.17,119.29 SW6.2 158.47,115.99 171.42,115.99 SW7.2 ; SW1.4 72.39,121.15 72.39,110.48 68.33,106.42 67.56,106.42 65.53,108.45 59.94,108.45 54.1,102.61 ; v1(52.58,92.19) v1(53.59,93.21) 53.59,102.1 54.1,102.61 ; 54.1,102.61 v1(54.1,92.7) v1(53.09,91.69)
COL2: length 205.2
  Top Layer w0.254: v1(131.67,96.81) 131.29,97.2 122.78,97.2 ; 122.78,97.2 122.4,97.2 120.62,98.97 108.18,98.97 SW10.2 104.49,99.1 91.92,99.1 SW9.2 88.44,99.02 ; 122.78,97.2 SW11.2 ; 122.78,97.2 123.29,97.7 v1(132.94,97.7) ; 82.07,99.02 78,99.02 v1(75.79,96.81) ; 82.07,99.02 v1(80.36,97.32) ; 82.07,99.02 88.44,99.02 ; 82.07,99.02 82.14,99.1 88.37,99.1 88.44,99.02 ; U2.23 45.2,97.79 47.24,95.75 47.24,83.81 R12.1
  Bottom Layer w0.254: SW13.2 154.79,98.59 141.71,98.59 SW12.2 ; SW13.2 154.79,95.04 151.87,95.04 150.09,96.81 SW12.2 ; SW13.2 158.34,95.04 171.55,95.04 SW14.2 ; v1(131.67,96.81) 133.45,96.81 ; 133.45,96.81 134.97,95.29 138.4,95.29 SW12.2 ; 133.45,96.81 132.94,97.32 v1(132.94,97.7) ; R12.1 46.99,83.56 51.31,83.56 53.34,81.53 53.85,81.53 61.47,89.15 63.75,89.15 71.93,97.32 SW8.2 75.28,97.32 ; 75.28,97.32 v1(80.36,97.32) ; 75.28,97.32 v1(75.79,96.81)
COL3: length 186.2
  Top Layer w0.254: SW16.2 88.54,77.97 86,77.97 v1(84.98,76.95) ; SW16.2 88.37,74.59 86.08,74.59 v1(84.3,76.37) ; SW16.2 91.79,74.72 104.62,74.72 SW17.2 107.92,74.46 121.38,74.46 SW18.2 124.56,74.34 138.66,74.34 SW19.2 141.96,74.08 154.79,74.08 SW20.2 v1(165.45,75.86) v1(165.96,76.37) ; 49.78,87.62 49.53,87.88 49.53,94.73 ; 49.78,87.62 55.88,81.53 57.66,81.53 R17.1 ; 49.78,87.62 49.78,94.48 49.53,94.73 ; 49.53,94.73 45.2,99.06 U2.22
  Bottom Layer w0.254: 74.06,76.45 84.48,76.45 v1(84.98,76.95) ; 74.06,76.45 64.77,76.45 ; 74.06,76.45 SW15.2 ; v1(165.45,75.86) v1(165.96,76.37) 167.23,77.64 171.68,77.64 SW21.2 ; SW15.2 v1(84.3,76.37) ; SW15.2 64.85,76.37 64.77,76.45 ; 64.77,76.45 R17.1
COL4: length 206.4
  Top Layer w0.254: 88.72,56.71 88.47,56.96 v1(87.38,56.96) ; 88.72,56.71 85.85,56.71 v1(84.33,55.19) ; 88.72,56.71 SW23.2 92.05,53.38 104.37,53.38 SW24.2 107.8,53.51 121.64,53.51 SW25.2 124.94,53.25 138.66,53.25 SW26.2 141.83,56.43 155.04,56.43 SW27.2 ; U2.21 44.2,100.33 42.67,98.8 42.67,84.57 45.72,81.53 47.5,81.53 R13.1 ; v1(170.79,60.49) 169.77,61.51 163.17,61.51 SW27.2 ; SW27.2 165.45,54.9 v1(168.25,57.7)
  Bottom Layer w0.254: 74.17,55.19 SW22.2 ; 74.17,55.19 74.17,55.62 48.51,81.27 R13.1 ; 74.17,55.19 75.95,56.96 v1(87.38,56.96) ; 74.17,55.19 v1(84.33,55.19) ; 170.79,57.7 SW28.2 ; 170.79,57.7 v1(168.25,57.7) ; 170.79,57.7 v1(170.79,60.49)
COL5: length 226.2
  Top Layer w0.254: v1(170.79,39.03) 170.79,39.28 169.77,40.3 163.17,40.3 SW34.2 ; v1(167.99,36.24) 165.45,33.7 SW34.2 ; SW30.2 88.62,35.73 75.92,35.73 75.69,35.5 ; SW30.2 92.05,32.3 104.75,32.3 SW31.2 108.05,35.6 121.38,35.6 SW32.2 124.94,32.04 138.78,32.04 SW33.2 141.96,35.22 155.04,35.22 SW34.2 ; SW30.2 88.62,32.17 75.92,32.17 SW29.2 75.69,35.5 ; 75.69,35.5 75.69,68.06 R18.1 54.86,88.89 54.86,90.92 46.23,99.56 46.23,100.58 45.2,101.6 U2.20
  Bottom Layer w0.254: v1(170.79,39.03) 170.79,36.62 171.17,36.24 ; 171.17,36.24 v1(167.99,36.24) ; 171.17,36.24 SW35.2
COL6: length 260.4
  Top Layer w0.254: 44.2,102.86 42.16,100.83 42.16,84.32 45.47,81.02 47.75,81.02 ; 44.2,102.86 44.65,102.86 U2.19 44.2,102.87 44.2,102.86 ; 72.39,56.38 72.39,57.9 48.77,81.53 ; 72.39,56.38 47.75,81.02 ; 72.39,56.38 72.39,14.62 SW36.2 76.05,10.96 88.62,10.96 SW37.2 92.05,11.09 104.62,11.09 SW38.2 107.8,10.96 121.64,10.96 SW39.2 124.94,10.71 138.78,10.71 SW40.2 142.09,14.01 155.04,14.01 SW41.2 v1(164.69,12.49) v1(165.45,12.49) ; 47.75,81.02 48.26,81.02 48.77,81.53 ; 47.75,81.02 48.26,81.53 48.77,81.53 ; 48.77,81.53 49.78,82.54 R14.1 50.04,81.53 48.77,81.53
  Bottom Layer w0.254: 167.23,10.71 166.47,10.71 v1(164.69,12.49) ; 167.23,10.71 v1(165.45,12.49) ; 167.23,10.71 171.93,10.71 SW42.2
CTRL1: length 27
  Top Layer w0.254: SW43.1 45.89,49.68 45.89,62.87 38.27,70.49 U3.8
CTRL2: length 38.1
  Top Layer w0.254: SW44.1 43.35,35.87 43.35,64.14 38.27,69.22 U3.7
CTRL3: length 51.9
  Top Layer w0.254: SW45.1 40.05,28.09 40.05,66.17 38.27,67.95 U3.6
CTRL4: length 74.5
  Top Layer w0.254: SW46.1 65.65,18.92 46.93,18.92 39.56,26.29 39.56,51.41 35.73,55.25 35.73,65.15 37.26,66.68 U3.5
CTRL5: length 81.4
  Top Layer w0.254: 36.24,60.86 36.24,60.83 v1(38.78,58.29) ; 36.24,60.86 36.24,64.39 37.26,65.41 U3.4 ; 36.24,60.86 v1(39.31,57.79)
  Bottom Layer w0.254: 62.68,35.16 62.68,35.18 40.07,57.79 40.05,57.79 ; 62.68,35.16 62.77,35.07 SW47.1 62.68,34.42 62.68,35.16 ; 62.68,35.16 40.05,57.79 ; 40.05,57.79 v1(39.31,57.79) ; 40.05,57.79 39.54,58.29 v1(38.78,58.29)
CTRL6: length 49.3
  Top Layer w0.254: 38.53,64.14 v1(39.29,63.37) ; 38.53,64.14 U3.3 ; 38.53,64.14 v1(39.29,64.14)
  Bottom Layer w0.254: v1(39.29,64.14) 50.87,64.14 51.63,63.37 ; 51.63,63.37 SW48.1 ; 51.63,63.37 v1(39.29,63.37)
E1: length 81.1
  Bottom Layer w0.254: J4.1 108.11,134.66 93.91,134.66 93.41,135.17 87.93,135.17 87.42,134.66 86.4,134.66 85.89,135.17 81.32,135.17 80.81,134.66 75.22,134.66 72.43,137.46 42.2,137.46 U1.14
E2: length 96.3
  Bottom Layer w0.254: J5.1 121.19,134.66 110.45,134.66 107.15,137.96 40.17,137.96 U1.15
E3: length 116.4
  Top Layer w0.254: J6.1 132.37,133.39 113.5,133.39 ; 113.5,133.39 112.74,133.39 v1(110.7,135.42) ; 113.5,133.39 v1(111.47,135.42)
  Bottom Layer w0.254: U1.16 38.14,138.47 107.4,138.47 110.45,135.42 v1(111.47,135.42)
E4: length 128.8
  Bottom Layer w0.254: J7.1 145.07,133.39 126.96,133.39 122.9,137.46 111.47,137.46 110.96,136.95 109.69,136.95 107.66,138.98 36.11,138.98 U1.17
E5: length 156.1
  Top Layer w0.254: v1(29.84,134.24) v1(29.08,134.24) 23.75,134.24 U1.20
  Bottom Layer w0.254: v1(29.08,134.24) 34.33,139.49 35.09,139.49 ; v1(29.84,134.24) 35.09,139.49 ; 35.09,139.49 110.19,139.49 110.96,138.73 155.48,138.73 J8.1
E6: length 163.7
  Top Layer w0.254: J9.1 169.96,132.88 108.75,132.88 103.67,137.96 61.55,137.96 58.25,134.66 55.92,134.66 55.67,134.92 22.9,134.92 16.38,128.4 U1.21
FP1: length 52
  Top Layer w0.254: RV1.2 17.14,31.3 18.67,31.3 33.4,46.03 33.4,67.87 37.28,71.76 U3.9
FP2: length 63.9
  Top Layer w0.254: 39.24,61.3 39.24,61.91 38.48,62.67 37.96,62.67 U3.2 38.38,62.87 39.34,61.91 39.34,61.4 39.24,61.3 ; 39.24,61.3 39.24,61.14 38.73,60.64 38.58,60.64 ; 39.24,61.3 38.58,60.64 ; v1(38.07,60.13) 38.58,60.64 ; 38.58,60.64 v1(38.48,60.64)
  Bottom Layer w0.254: 37.97,60.13 v1(38.48,60.64) ; 37.97,60.13 29.34,60.13 21.46,52.25 ; 37.97,60.13 30.1,52.25 21.46,52.25 ; 37.97,60.13 v1(38.07,60.13) ; 21.46,52.25 21.21,52.25 RV2.2 16.13,46.92 21.46,52.25
LED: length 22.4
  Top Layer w0.2: 35.62,109.6 34.86,110.36 v1(32.89,110.36) ; 35.62,109.6 v1(32.89,109.6) ; 35.62,109.6 U4.1 ; 30.86,111.63 21.97,111.63 U1.6 ; 30.86,111.63 v1(31.11,111.38) ; 30.86,111.63 31.62,111.63 v1(31.88,111.38)
  Bottom Layer w0.2: v1(31.88,111.38) v1(32.89,110.36) ; v1(31.11,111.38) v1(32.89,109.6)
LEDCNTRL: length 47
  Top Layer w0.2: D1.4 72.29,112.99 68.48,116.8 62.38,116.8 60.86,115.28 60.86,115.02 57.05,111.21 49.17,111.21 v1(47.9,109.94) ; U4.20 37.55,109.57 v1(37.55,110)
  Bottom Layer w0.2: v1(37.55,110) 38.57,108.99 46.95,108.99 v1(47.9,109.94)
MAIN: length 13.7
  Top Layer w0.254: U3.23 20.9,62.87 18.8,60.76 17.27,60.76 RV3.2
MIDI_IN: length 18.4
  Top Layer w0.2: v1(38.41,109.98) 38.41,109.47 38.04,109.1 U4.19
  Top Layer w0.254: 48.26,120.02 43.62,120.02 R1.1
  Bottom Layer w0.2: R1.1 38.41,114.81 v1(38.41,109.98)
MIDI_OUT: length 63.8
  Top Layer w0.2: v1(41.15,112.88) 46.92,118.65 49.28,118.65 68.07,137.45 72.39,137.45 75.18,134.65 80.77,134.65 82.3,136.18 J3.3 ; U4.18 38.24,108.7 v1(39.12,109.57)
  Bottom Layer w0.2: v1(41.15,112.88) 39.12,110.84 v1(39.12,109.57)
MIDII3: length 41.7
  Top Layer w0.2: v1(34.42,113.41) v1(34.42,112.65) 34.42,112.14 ; 34.42,112.14 34.42,111.89 36.7,109.6 ; 34.42,112.14 36.7,109.86 36.7,109.6 ; v1(32.13,114.94) v1(31.37,114.94) 6.98,114.94 U1.0 ; 36.7,109.6 36.7,109.35 36.44,109.09 U4.2
  Bottom Layer w0.2: v1(31.37,114.94) v1(32.13,114.94) 32.89,114.94 v1(34.42,113.41) v1(34.42,112.65)
MIDIO3: length 31.1
  Top Layer w0.2: U1.1 12.32,108.59 26.18,108.59 27.81,110.22 28.58,110.22 30.1,108.7 U4.3
MRC: length 79.7
  Top Layer w0.254: v1(37.72,60.83) 37.72,61.55 U3.1
  Bottom Layer w0.254: U1.23 11.56,127.13 11.56,87 v1(37.72,60.83)
MRR: length 82.2
  Top Layer w0.254: v1(15.37,125.86) 27.05,125.86 ; 27.05,125.86 v1(33.4,119.51) v1(33.91,119) ; 27.05,125.86 26.54,126.37 v1(14.86,126.37) ; v1(41.02,105.54) v1(41.53,105.03) 43.05,103.51 45.85,103.51 52.83,96.52 U2.1
  Bottom Layer w0.254: 37.47,110.87 37.97,111.38 37.97,117.48 37.47,117.98 ; 37.47,110.87 36.96,110.36 36.96,109.6 v1(41.02,105.54) v1(41.53,105.03) ; 37.47,110.87 37.47,117.98 ; 37.47,117.98 35.94,119.51 34.42,119.51 ; v1(33.4,119.51) 34.42,119.51 ; 34.42,119.51 v1(33.91,119) ; v1(15.37,125.86) v1(14.86,126.37) U1.22
MUXC1: length 67.1
  Top Layer w0.254: 37.51,73.28 37.26,73.53 v1(36.45,73.53) ; 37.51,73.28 U3.10 ; 37.51,73.28 v1(35.69,73.28)
  Bottom Layer w0.254: 25.78,88.77 25.78,83.19 v1(35.69,73.28) ; 25.78,88.77 36.45,78.11 v1(36.45,73.53) ; 25.78,88.77 25.78,112.9 U1.8
MUXC2: length 55.5
  Top Layer w0.254: 39.24,96.65 39.24,75.31 38.23,74.3 U3.11 ; 39.24,96.65 36.45,99.44 36.45,103.51 v1(37.21,104.27) ; 39.24,96.65 39.24,103.25 v1(38.73,103.76)
  Bottom Layer w0.254: v1(37.21,104.27) 36.96,104.27 36.45,104.78 ; 36.45,104.78 38.23,104.78 38.73,104.27 v1(38.73,103.76) ; 36.45,104.78 U1.9
MUXC3: length 47.1
  Top Layer w0.254: 28.32,108.84 28.32,77.34 26.8,75.82 26.8,75.31 27.81,74.3 U3.14 ; 28.32,108.84 v1(28.58,109.09) ; 28.32,108.84 28.32,109.35 v1(28.07,109.6)
  Bottom Layer w0.254: v1(28.58,109.09) v1(28.07,109.6) 26.8,110.87 26.8,113.41 27.81,114.43 29.34,114.43 U1.10
MUXC4: length 84.3
  Top Layer w0.254: 28.32,75.61 U3.13 ; 28.32,75.61 v1(28.32,76.33) ; 28.32,75.61 28.83,76.12 v1(28.83,76.84) ; 25.78,110.62 32.13,110.62 33.15,111.63 U1.11 ; 25.78,110.62 25.02,110.62 v1(24.26,109.86) ; 25.78,110.62 v1(25.02,109.86)
  Bottom Layer w0.254: 25.02,80.65 v1(28.83,76.84) ; 25.02,80.65 24.26,81.41 v1(24.26,109.86) ; 25.02,80.65 25.02,79.63 v1(28.32,76.33) ; 25.02,80.65 v1(25.02,109.86)
MUXR1: length 50.3
  Top Layer w0.254: v1(37.97,104.01) 41.28,107.32 45.85,107.32 46.48,107.95 U2.10 ; v1(26.54,109.86) 25.78,109.09 14.35,109.09 U1.2
  Bottom Layer w0.254: v1(26.54,109.86) 28.07,108.33 32.13,108.33 36.96,103.51 37.47,103.51 v1(37.97,104.01)
MUXR2: length 43.9
  Top Layer w0.254: U1.3 13.94,114.27 37.36,114.27 40.51,111.13 45.85,111.13 47.75,109.22 U2.11
MUXR3: length 45.1
  Top Layer w0.254: v1(19.69,115.7) 20.95,116.97 ; 20.95,116.97 35.94,116.97 41.02,111.89 v1(41.78,111.89) v1(42.55,111.89) ; 20.95,116.97 20.19,116.97 v1(18.92,115.7) ; v1(42.55,109.86) v1(43.31,109.86) 44.02,109.86 U2.14
  Bottom Layer w0.254: 42.55,110.62 41.78,111.38 v1(41.78,111.89) ; 42.55,110.62 v1(43.31,109.86) ; 42.55,110.62 v1(42.55,109.86) ; 42.55,110.62 v1(42.55,111.89) ; v1(18.92,115.7) 17.91,115.7 U1.4 16.38,113.16 v1(18.92,115.7) ; v1(18.92,115.7) v1(19.69,115.7)
MUXR4: length 41.1
  Top Layer w0.254: v1(22.48,110.62) 20.45,110.62 20.19,110.87 ; 20.19,110.87 v1(23.75,110.87) ; 20.19,110.87 U1.5 ; U2.13 44.53,110.62 36.96,110.62 v1(36.2,111.38) v1(35.69,111.89)
  Bottom Layer w0.254: 32.89,111.89 v1(35.69,111.89) ; 32.89,111.89 31.88,112.9 31.88,113.41 30.35,114.94 25.78,114.94 24.26,113.41 24.26,112.4 ; 32.89,111.89 33.4,111.38 v1(36.2,111.38) ; 24.26,112.4 v1(22.48,110.62) ; 24.26,112.4 24.26,111.38 v1(23.75,110.87)
ROW1: length 193.9
  Top Layer w0.254: 80.78,102.62 80.82,102.66 80.82,113.83 ; 80.78,102.62 80.78,100.66 v1(81.8,99.64) ; 80.78,102.62 80.78,113.82 84.74,117.77 ; 80.78,102.62 v1(77.77,99.61) ; R7.1 61.48,105.99 61.48,107.77 60.72,108.53 60.21,108.53 58.36,106.68 U2.9 ; 84.74,117.77 SW1.1 ; 84.74,117.77 84.74,117.78
  Bottom Layer w0.254: 86.48,97.36 85.75,98.08 82.56,98.08 ; 86.48,97.36 SW8.1 84.99,95.8 84.99,78.02 SW15.1 88.42,74.59 88.42,56.94 SW22.1 84.86,53.38 84.86,35.73 SW29.1 85.12,32.43 85.12,14.39 SW36.1 ; 86.48,97.36 82.56,97.36 ; 82.56,97.36 82.56,98.08 ; 82.56,97.36 81.29,97.36 80.56,98.08 ; 82.56,98.08 80.56,98.08 ; 82.56,98.08 82.56,98.88 v1(81.8,99.64) ; 80.56,98.08 78.53,98.08 78.28,97.83 ; 80.56,98.08 79.77,98.88 78.28,98.88 ; 75.96,98.88 78.28,98.88 ; 75.96,98.88 77.01,97.83 78.28,97.83 ; 75.96,98.88 66.56,98.88 66.49,98.95 ; 75.96,98.88 75.89,98.95 66.49,98.95 ; 78.28,98.88 78.28,99.1 v1(77.77,99.61) ; 78.28,98.88 78.28,97.83 ; R7.1 66.49,98.95
ROW2: length 187.8
  Top Layer w0.254: U2.8 58.38,105.41 R6.1
  Bottom Layer w0.254: 102.37,97.34 101.1,98.61 101.1,116.23 SW2.1 ; 102.37,97.34 101.36,97.34 98.31,100.38 68.84,100.38 68.34,100.89 67.07,100.89 R6.1 ; 102.37,97.34 SW9.1 ; SW37.1 101.12,14.52 101.12,32.17 SW30.1 101.25,35.6 101.25,53.63 SW23.1 101.12,56.81 101.12,74.84 SW16.1 ; SW9.1 104.42,95.54 104.42,78.15 SW16.1 ; SW9.1 100.87,95.54 100.87,78.15 SW16.1
ROW3: length 226.3
  Top Layer w0.254: 117.1,97.1 v1(117.1,97.61) ; 117.1,97.1 117.61,97.1 ; 117.1,97.1 116.34,97.1 114.82,95.58 ; 117.61,97.1 116.09,95.58 114.82,95.58 ; 117.61,97.1 118.12,97.1 ; 118.12,97.1 118.12,97.61 v1(117.61,98.12) ; 118.12,97.1 118.81,97.1 SW10.1 ; U2.7 58.76,104.14 R8.1 66.56,96.34 72.65,96.34 73.42,95.58 114.82,95.58
  Bottom Layer w0.254: v1(117.1,97.61) 117.1,77.78 SW17.1 ; v1(117.1,97.61) v1(117.61,98.12) 117.36,98.37 117.36,116.23 ; v1(117.1,97.61) 117.1,115.97 117.36,116.23 ; 117.36,116.23 SW3.1 ; SW17.1 120.42,74.46 120.42,56.94 SW24.1 ; SW17.1 116.87,74.46 116.87,56.94 SW24.1 ; SW24.1 117.12,53.63 117.12,35.47 SW31.1 120.3,32.3 120.3,14.26 SW38.1
ROW4: length 281.4
  Top Layer w0.254: 130.57,95.07 73.16,95.07 72.4,95.83 64.53,95.83 R9.1 57.49,102.87 U2.6 53.68,102.87 52.59,103.96 52.59,107.01 52.84,107.26 57.67,107.26 R5.1 ; 130.57,95.07 130.82,95.07 131.84,96.09 ; 130.57,95.07 131.58,96.09 131.84,96.09 ; 131.84,96.09 132.82,97.07 133.83,97.07 ; 131.84,96.09 v1(132.6,95.32) ; 133.83,97.07 133.83,102.91 129.52,107.23 129.52,113.58 133.58,117.64 135.03,117.64 SW4.1 ; 133.83,97.07 134.6,97.07 ; 134.6,97.07 SW11.1 ; 134.6,97.07 134.6,95.8 v1(134.09,95.29)
  Bottom Layer w0.254: 133.83,77.56 SW18.1 ; 133.83,77.56 132.6,78.8 v1(132.6,95.32) ; 133.83,77.56 133.83,95.04 v1(134.09,95.29) ; SW18.1 133.88,74.46 133.88,56.81 SW25.1 ; SW18.1 137.44,73.95 137.44,56.81 SW25.1 ; SW25.1 133.88,53.25 133.88,35.6 SW32.1 ; SW32.1 133.88,32.04 133.88,14.26 SW39.1 137.44,14.26 137.44,32.04 SW32.1
ROW5: length 223.6
  Top Layer w0.254: v1(152.68,92.75) 152.43,93 152.43,93.77 ; 148.57,96.81 SW12.1 152.43,93.77 ; 148.57,96.81 146.79,98.59 ; 148.57,96.81 147.8,96.81 ; 152.43,93.77 v1(152.68,93.51) ; 147.8,96.81 147.3,96.81 145.04,94.56 69.1,94.56 68.34,93.8 64.02,93.8 R10.1 56.22,101.6 U2.5 ; 147.8,96.81 146.79,97.83 146.79,98.59 ; 146.79,98.59 146.79,113.4 151.03,117.64 SW5.1
  Bottom Layer w0.254: v1(152.68,92.75) 150.9,90.97 ; 150.9,90.97 150.9,91.73 v1(152.68,93.51) ; 150.9,90.97 150.9,77.64 SW19.1 154.46,74.08 154.46,56.56 SW26.1 151.16,53.25 151.16,35.22 SW33.1 151.03,31.79 151.03,14.01 SW40.1
ROW6: length 265.7
  Top Layer w0.254: 57.15,89.65 57.15,97.78 54.61,100.32 54.16,100.32 U2.4 ; 57.15,89.65 61.72,85.08 162.05,85.08 ; 57.15,89.65 56.39,88.89 ; 162.05,85.08 162.05,83.81 v1(164.34,81.53) v1(164.85,81.02) ; 162.05,85.08 163.32,86.35 163.32,92.45 167.64,96.77 ; v1(169.93,115.31) 169.93,117.03 SW6.1 169.16,117.74 v1(169.16,115.31) ; 167.64,96.77 v1(167.39,97.02) ; 167.64,96.77 167.89,96.77 ; 167.89,96.77 169.02,96.77 SW13.1 ; 167.89,96.77 167.89,97.53 v1(167.64,97.78) ; v1(55.88,88.89) 56.39,88.89 ; 56.39,88.89 v1(56.39,88.38)
  Bottom Layer w0.254: SW20.1 168.3,75.1 ; 168.3,75.1 165.35,75.1 164.85,75.61 ; 168.3,75.1 167.29,74.08 167.29,56.68 SW27.1 167.29,53.13 167.29,35.47 SW34.1 167.29,31.92 167.29,14.26 SW41.1 ; R15.1 53.59,85.59 ; 53.59,85.59 v1(56.39,88.38) ; 53.59,85.59 53.59,86.61 v1(55.88,88.89) ; 167.39,112.77 167.39,113.53 v1(169.16,115.31) ; 167.39,112.77 v1(169.93,115.31) ; 167.39,112.77 167.39,98.04 ; v1(167.64,97.78) 167.39,98.04 ; 167.39,98.04 v1(167.39,97.02) ; 164.85,75.61 164.34,76.11 v1(164.34,81.53) ; 164.85,75.61 v1(164.85,81.02)
ROW7: length 257.6
  Top Layer w0.254: 146.82,94.05 69.35,94.05 68.59,93.29 61.99,93.29 R11.1 60.46,95.83 55.38,100.91 52.84,100.91 52.59,100.66 52.59,100.15 53.68,99.06 U2.3 ; 146.82,94.05 149.62,94.05 v1(150.38,94.82) ; 146.82,94.05 v1(148.09,95.32)
  Bottom Layer w0.254: SW7.1 184.13,116.19 184.13,97.58 184.89,96.81 ; v1(148.09,95.32) 148.85,94.56 150.63,94.56 ; 184.89,96.81 184.63,96.81 182.38,94.56 150.63,94.56 ; 184.89,96.81 SW14.1 184.3,95.29 184.3,77.51 SW21.1 184.43,74.34 184.43,56.56 SW28.1 184.56,53.38 184.56,35.35 SW35.1 184.43,31.92 184.43,14.26 SW42.1 ; v1(150.38,94.82) 150.63,94.56
SCL: length 25.3
  Bottom Layer w0.254: J10.3 19.18,105.41 19.18,113.41 20.45,114.68 U1.19
SDA: length 25.3
  Bottom Layer w0.254: U1.18 21.72,127.13 21.72,105.41 J10.4
TPWR: length 24.6
  Top Layer w0.254: U1.VIN 2.67,128.91 13.08,139.32 22.41,139.32 SW49.2
$1N1: length 109.6
  Top Layer w0.254: D35.2 181.59,22.65 167.41,8.47 80.16,8.47 D36.4
$1N4: length 15.2
  Top Layer w0.254: D15.2 90.15,65.83 D16.4
$1N5: length 21.1
  Top Layer w0.254: D27.1 162.16,45.2 162.16,50.25 161.9,50.51 149.2,50.51 D26.3
$1N6: length 14.2
  Bottom Layer w0.254: R3.1 52.88,120.48 57.92,115.43 D43.1
$1N7: length 21.1
  Top Layer w0.254: D29.3 83.29,29.68 95.73,29.68 96.24,29.17 96.24,24.38 D30.1
$1N8: length 21.9
  Top Layer w0.254: D5.1 145.52,108.45 145.52,113.63 145.26,113.88 131.55,113.88 D4.3
$1N11: length 14.8
  Top Layer w0.254: D23.3 105.9,49.62 D24.1
$1N12: length 21.2
  Top Layer w0.254: D3.3 114.91,114.01 128.12,114.01 128.37,113.75 128.37,108.7 D4.1
$1N13: length 21
  Top Layer w0.254: D22.2 83.29,43.35 95.73,43.35 95.99,43.6 95.99,48.78 D23.4
$1N15: length 15.3
  Top Layer w0.254: D37.1 90.15,7.2 D36.3
$1N17: length 21.5
  Top Layer w0.254: D12.1 145.52,87.37 145.52,92.42 145.26,92.67 131.8,92.67 D11.3
$1N19: length 16
  Top Layer w0.254: D32.1 122.79,28.28 D31.3
$1N20: length 21.9
  Top Layer w0.254: D19.1 144.09,64.6 130.02,64.6 129.77,64.86 129.77,69.68 D18.3
$1N23: length 16.3
  Top Layer w0.254: D35.4 173.59,23.15 D34.2
$1N24: length 26.2
  Bottom Layer w0.254: R4.2 83.03,124.84 J3.4
$1N25: length 21.4
  Top Layer w0.254: D10.3 114.78,92.8 128.5,92.8 128.75,92.54 128.75,87.62 D11.1
$1N26: length 16.1
  Top Layer w0.254: D21.1 173.33,70.57 D20.3
$1N27: length 15.9
  Top Layer w0.254: D38.3 122.66,7.07 D39.1
$1N29: length 21.7
  Top Layer w0.254: D17.3 112.88,69.81 112.88,64.98 113.13,64.73 126.82,64.73 D18.1
$1N30: length 118.7
  Top Layer w0.254: 151.11,114.39 v1(150.09,113.37) ; 151.11,114.39 149.84,114.39 v1(148.82,113.37) ; 151.11,114.39 179.3,114.39 D7.3 ; v1(124.94,91.02) v1(124.44,90.51) 119.86,85.94 80.11,85.94 D8.1
  Bottom Layer w0.254: v1(150.09,113.37) 149.07,113.37 148.82,113.12 ; 148.82,113.12 v1(148.82,113.37) ; 148.82,113.12 134.09,98.39 132.31,98.39 v1(124.94,91.02) v1(124.44,90.51)
$1N31: length 15.1
  Top Layer w0.254: D10.1 106.02,92.04 D9.3
$1N32: length 16
  Top Layer w0.254: D13.2 173.33,86.65 D14.4
$1N33: length 16.1
  Top Layer w0.254: D32.3 139.8,28.15 D33.1
$1N34: length 21
  Top Layer w0.254: D15.3 81,69.81 81,64.98 81.26,64.73 94.05,64.73 D16.1
$1N37: length 29.3
  Top Layer w0.254: 162.28,113.5 162.28,113.63 162.03,113.88 161.9,113.88 ; 162.28,113.5 162.28,108.45 ; 162.28,113.5 162.41,113.37 162.41,108.58 162.28,108.45 ; 162.28,113.5 161.9,113.88 ; 158.85,112.61 159.11,112.61 160.38,113.88 ; 158.85,112.61 160.12,113.88 160.38,113.88 ; 158.85,112.61 D5.3 ; 161.9,113.88 160.38,113.88 ; 162.28,108.45 D6.1
$1N38: length 15.5
  Top Layer w0.254: D20.4 156.19,65.45 D19.2
$1N39: length 21.9
  Top Layer w0.254: D20.2 165.58,64.3 178.79,64.3 179.3,64.81 179.3,69.6 D21.4
$1N40: length 120.4
  Top Layer w0.254: D35.3 179.55,26.12 179.55,22.31 176.51,19.26 173.2,19.26 163.04,9.1 79.15,9.1 77.88,7.83 77.88,3.22 D36.1
$1N43: length 21.8
  Top Layer w0.254: D24.3 114.91,50.63 128.63,50.63 128.88,50.38 128.88,45.46 D25.1
$1N45: length 109.3
  Top Layer w0.254: D21.2 181.33,64.92 167.56,51.14 80.54,51.14 D22.4
$1N46: length 21.9
  Top Layer w0.254: D32.2 132.18,21.88 145.65,21.88 145.9,22.14 145.9,27.06 D33.4
$1N51: length 21.3
  Top Layer w0.254: D12.2 148.69,85.51 161.9,85.51 162.16,85.77 162.16,90.69 D13.4
$1N54: length 15.7
  Top Layer w0.254: D6.3 173.08,112.61 D7.1
$1N56: length 109.1
  Top Layer w0.254: D14.2 181.21,86.02 170.54,75.35 170.54,75.1 167.54,72.1 80.29,72.1 D15.4
$1N57: length 21.1
  Top Layer w0.254: D37.4 96.12,6.23 96.12,1.44 95.61,0.93 83.16,0.93 D36.2
$1N58: length 20.8
  Top Layer w0.254: D9.1 95.99,88 95.99,92.93 95.73,93.18 83.16,93.18 D8.3
$1N59: length 21.1
  Top Layer w0.254: D41.1 162.28,2.79 162.28,7.71 162.03,7.96 149.33,7.96 D40.3
$1N60: length 21.8
  Top Layer w0.254: D14.1 178.21,89.67 179.17,90.64 179.17,92.42 178.92,92.67 165.2,92.67 D13.3
$1N61: length 109.9
  Top Layer w0.254: D8.4 80.62,93.64 147.3,93.64 148.82,92.12 154.92,92.12 161.27,98.47 172.19,98.47 181.08,107.36 D7.2
$1N62: length 15.4
  Top Layer w0.254: D33.3 156.44,28.03 D34.1
$1N63: length 24.7
  Top Layer w0.254: D42.1 180.06,2.91 180.06,7.83 179.81,8.09 178.28,8.09 ; 178.28,8.09 177.01,6.82 176.76,6.82 ; 178.28,8.09 178.03,8.09 176.76,6.82 ; 176.76,6.82 D41.3
$1N64: length 16.2
  Top Layer w0.254: D25.3 139.68,49.49 D26.1
$1N65: length 20.5
  Top Layer w0.254: D31.1 111.99,24.25 111.99,29.17 111.74,29.42 99.29,29.42 D30.3
$1N66: length 21
  Top Layer w0.254: D34.4 162.16,27.31 162.16,22.27 161.9,22.01 148.95,22.01 D33.2
$1N68: length 14.8
  Top Layer w0.254: D17.1 105.9,70.83 D16.3
$1N70: length 120.3
  Top Layer w0.254: D21.3 179.81,69.05 179.81,64.73 176.76,61.68 173.19,61.68 163.28,51.78 79.53,51.78 78,50.25 78,45.63 D22.1
$1N71: length 15.1
  Top Layer w0.254: D3.1 105.9,112.99 D2.3
$1N74: length 21.1
  Top Layer w0.254: D2.1 95.86,108.96 95.86,113.75 95.35,114.26 82.91,114.26 D1.3
$1N75: length 21.6
  Top Layer w0.254: D32.4 128.75,27.31 128.75,22.27 128.5,22.01 115.29,22.01 D31.2
$1N78: length 20.9
  Top Layer w0.254: D3.4 111.86,112.02 111.86,107.23 111.35,106.72 99.16,106.72 D2.2
$1N79: length 16.2
  Top Layer w0.254: D27.3 173.46,49.36 D28.1
$1N82: length 25.8
  Top Layer w0.254: 178.59,26.3 178.59,26.42 179.43,27.27 ; 178.59,26.3 D35.1 ; 178.59,26.3 179.43,27.14 179.43,27.27 ; 179.43,29.04 179.55,28.92 179.55,27.39 179.43,27.27 ; 179.43,29.04 179.43,29.17 179.17,29.42 179.05,29.42 ; 179.43,29.04 179.05,29.42 ; 179.43,29.04 179.43,27.27 ; 179.05,29.42 165.58,29.42 D34.3
$1N90: length 109.3
  Top Layer w0.254: D29.4 80.75,30.14 167.74,30.14 181.46,43.86 D28.2
$1N92: length 21.3
  Top Layer w0.254: D19.3 146.91,69.43 146.91,64.6 147.17,64.35 160.09,64.35 D20.1
$1N93: length 15.9
  Top Layer w0.254: D18.4 122.91,65.83 D17.2
$1N94: length 22
  Top Layer w0.254: D26.4 145.9,48.27 145.9,43.47 145.39,42.97 132.44,42.97 D25.2
$1N96: length 15
  Top Layer w0.254: D37.3 105.9,7.2 D38.1
$1N97: length 24
  Bottom Layer w0.254: 55.88,120.02 59.2,123.33 D43.2 59.7,124.09 61.73,126.12 63.76,126.12 71.64,134 J2.5
$1N107: length 15.2
  Top Layer w0.254: D23.1 90.15,49.62 D22.3
$1N108: length 22
  Top Layer w0.254: D39.3 131.8,7.96 145.52,7.96 146.03,7.45 146.03,2.66 D40.1
$1N112: length 15.7
  Top Layer w0.254: D4.4 122.66,107.99 D3.2
$1N121: length 15.5
  Top Layer w0.254: D26.2 156.19,44.24 D27.4
$1N122: length 22.7
  Bottom Layer w0.254: SW49.4 27.93,138.1 SW49.6 24.22,135.54 C1.2 22.62,134.44 J1.1
$1N123: length 15.5
  Top Layer w0.254: D13.1 156.31,91.53 D12.3
$1N124: length 16.1
  Top Layer w0.254: D5.4 139.93,107.86 D4.2
$1N125: length 15.3
  Top Layer w0.254: D30.4 90.27,23.41 D29.2
$1N126: length 16.2
  Top Layer w0.254: D40.4 140.31,1.95 D39.2
$1N127: length 16.1
  Top Layer w0.254: D19.4 140.19,65.7 D18.2
$1N128: length 15.8
  Top Layer w0.254: D5.2 156.44,107.61 D6.4
$1N131: length 15.9
  Top Layer w0.254: D11.2 139.8,86.65 D12.4
$1N132: length 119.8
  Top Layer w0.254: D15.1 78,66.84 78,71.46 79.27,72.73 163.16,72.73 173.06,82.64 176.12,82.64 179.17,85.69 179.17,89.5 D14.3
$1N133: length 20.6
  Top Layer w0.254: D24.4 111.86,48.65 111.86,43.86 111.35,43.35 99.42,43.35 D23.2
$1N134: length 14.8
  Top Layer w0.254: D30.2 106.15,23.41 D31.4
$1N136: length 22
  Top Layer w0.254: D27.2 163.3,45.38 163.3,50.21 163.55,50.46 177.36,50.46 D28.4
$1N138: length 120.2
  Top Layer w0.254: D28.3 179.43,47.33 179.43,43.52 176.38,40.47 173.08,40.47 163.17,30.57 79.53,30.57 78,29.04 78,24.42 D29.1
$1N139: length 15.1
  Top Layer w0.254: D9.4 90.02,87.04 D8.2
$1N141: length 42.9
  Top Layer w0.254: D6.2 165.71,106.34 178.66,106.34 178.92,106.59 178.92,111.77 D7.4 176.98,113.71 163.68,113.71 163.43,113.45 163.43,108.63 D6.2
$1N142: length 20.6
  Top Layer w0.254: D38.4 111.86,6.23 111.86,1.18 111.61,0.93 99.42,0.93 D37.2
$1N144: length 16.9
  Top Layer w0.254: D41.2 173.97,1.82 D42.4
$1N145: length 15.4
  Top Layer w0.254: D40.2 156.19,1.69 D41.4
$1N146: length 20.6
  Top Layer w0.254: D16.2 99.42,64.56 111.35,64.56 111.86,65.06 111.86,69.86 D17.4
$1N147: length 15.3
  Top Layer w0.254: D1.2 89.89,107.99 D2.4
$1N148: length 20.8
  Top Layer w0.254: D10.4 109.93,93.13 97.26,93.13 97,92.88 97,88.05 D9.2
$1N149: length 21.7
  Top Layer w0.254: D38.2 115.29,0.8 128.5,0.8 128.75,1.06 128.75,5.98 D39.4
$1N151: length 15.7
  Top Layer w0.254: D11.4 118.64,91.65 D10.2
$1N152: length 16
  Top Layer w0.254: D24.2 123.04,44.62 D25.4
$1N2399: length 4.8
  Bottom Layer w0.254: R2.2 45.91,119.82 48.26,117.48
$1N19678: length 46.2
  Top Layer w0.254: R3.2 46.34,126.69 v1(53.39,126.69) v1(53.89,126.18)
  Bottom Layer w0.254: 61.52,126.69 68.37,133.55 J2.4 62.28,126.69 61.52,126.69 ; 61.52,126.69 v1(53.39,126.69) ; 61.52,126.69 60.75,125.93 54.15,125.93 v1(53.89,126.18)

## Text on the board
Document Layer: MOARkNOBS-42
Top Silkscreen Layer: MAIN | f1 | f2 | brain | PWR | MOAR k NOBS - 42 | v1.04 | MIDI OUT | 1x2 | 1x1 | LED | MIDI IN | EF1 | EF2 | EF3 | EF4 | EF5 | EF6 | 7x6 | \\  |  / / CNTRL / /  |  \\
